# Altium schematic sheet PADS_Sheet_Yalovskyi.SchDoc
size A4; SheetNumber: 1; SheetTotal: 1
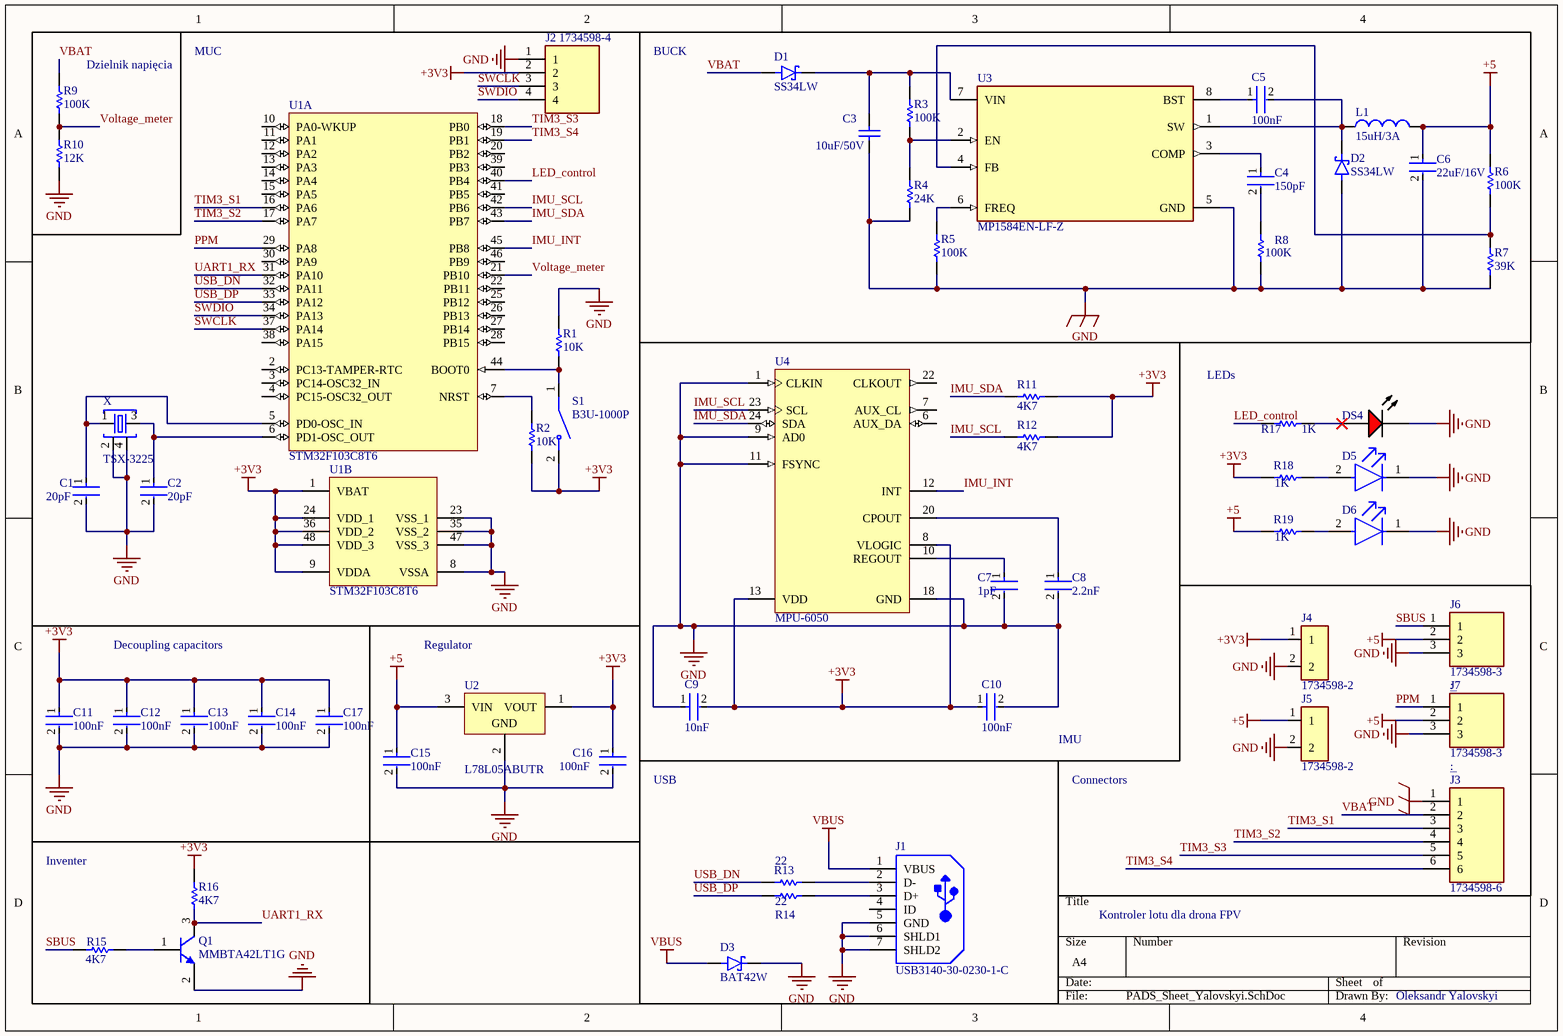
[diagram p0: PADS_Sheet_Yalovskyi.SchDoc]

## Parts
C1  20pF  [FP-C0402-BB-MFG]
C2  20pF  [FP-C0402-BB-MFG]
C3  10uF/50V  [KEMT-1206-2_M]
C4  150pF  [FP-C0402-BB-MFG]
C5  100nF  [FP-C0402-BB-MFG]
C6  22uF/16V  [FP-C0402-BB-MFG]
C7  1pF  [FP-C0402-BB-MFG]
C8  2.2nF  [FP-C0402-BB-MFG]
C9  10nF  [FP-C0402-BB-MFG]
C10  100nF  [FP-C0402-BB-MFG]
C11  100nF  [FP-C0402-BB-MFG]
C12  100nF  [FP-C0402-BB-MFG]
C13  100nF  [FP-C0402-BB-MFG]
C14  100nF  [FP-C0402-BB-MFG]
C15  100nF  [FP-C0402-BB-MFG]
C16  100nF  [FP-C0402-BB-MFG]
C17  100nF  [FP-C0402-BB-MFG]
D1  SS34LW  [SODFL3718X102N]
D2  SS34LW  [SODFL3718X102N]
D3  BAT42W  [DIO_BAT42W_RHG]
D5  (no value)  [FP-LTST-C190GKT-MFG]
D6  (no value)  [FP-LTST-C191TBKT-MFG]
DS4  (no value)  [VISH-TLMX1100_V]
J1  USB3140-30-0230-1-C  [GCT-USB3140_V]
J2  1734598-4  [TE_1734598-4]
J3  1734598-6  [TE_1734598-6]
J4  1734598-2  [TE_1734598-2]
J5  1734598-2  [TE_1734598-2]
J6  1734598-3  [TE_1734598-3]
J7  1734598-3  [TE_1734598-3]
L1  15uH/3A  [INDC1608X90X30LL10T20]
Q1  MMBTA42LT1G  [ONSC-SOT-23-3-318-08_V]
R1  10K  [RESC2013X50X30LL20T20]
R2  10K  [RESC2013X50X30LL20T20]
R3  100K  [RESC1005X40X25ML05T10]
R4  24K  [RESC1005X40X25ML05T10]
R5  100K  [RESC1005X40X25ML05T10]
R6  100K  [RESC1005X40X25ML05T10]
R7  39K  [RESC1005X40X25ML05T10]
R8  100K  [RESC1005X40X25ML05T10]
R9  100K  [RESC2013X50X30LL20T20]
R10  12K  [RESC2013X50X30LL20T20]
R11  4K7  [RESC1005X40X25ML05T10]
R12  4K7  [RESC1005X40X25ML05T10]
R13  22  [RESC2013X50X30LL20T20]
R14  22  [RESC2013X50X30LL20T20]
R15  4K7  [RESC2013X50X30LL20T20]
R16  4K7  [RESC2013X50X30LL20T20]
R17  1K  [RESC2013X50X30LL20T20]
R18  1K  [RESC2013X50X30LL20T20]
R19  1K  [RESC2013X50X30LL20T20]
S1  B3U-1000P  [SW_B3U-1000P]
U1  STM32F103C8T6  [STM-LQFP48_L]  (parts A,B of 2)
U2  L78L05ABUTR  [SOT-89_N]
U3  MP1584EN-LF-Z  [FP-MP1584EN-LF-Z-MFG]
U4  MPU-6050  [IS-QFN-24_V]
X  TSX-3225  [TSX-3225]

## Blocks framed on the sheet
Dzielnik napięcia: R9 R10
MUC: C1 C2 J2 R1 R2 S1 U1 X
BUCK: C3-C6 D1 D2 L1 R3-R8 U3
IMU: C7-C10 R11 R12 U4
Decoupling capacitors: C11-C14 C17
Regulator: C15 C16 U2
Connectors: J3-J7
Inventer: Q1 R15 R16

## Nets
+3V3: C9.2 C10.1 C11.1 C12.1 C13.1 C14.1 C16.1 C17.1 J2.2 J4.1 R2.1 R11.1 R12.1 R16.2 R18.2 S1.2 U1.1(VBAT) U1.9(VDDA) U1.24(VDD_1) U1.36(VDD_2) U1.48(VDD_3) U2.1(VOUT) U4.8(VLOGIC) U4.13(VDD)
+5: C6.1 C15.1 J5.1 J6.2 J7.2 L1.2 R6.2 R19.2 U2.3(VIN)
GND: C1.2 C2.2 C3.2 C6.2 C7.2 C8.2 C9.1 C10.2 C11.2 C12.2 C13.2 C14.2 C15.2 C16.2 C17.2 D2.A D3.C(K) D5.1(C) D6.1(C) DS4.2(K) J1.5(GND) J1.6(SHLD1) J1.7(SHLD2) J2.1 J3.1 J4.2 J5.2 J6.3 J7.3 Q1.2(E) R1.2 R4.1 R5.1 R7.1 R8.1 R10.1 U1.8(VSSA) U1.23(VSS_1) U1.35(VSS_2) U1.47(VSS_3) U2.2(GND) U3.5(GND) U4.1(CLKIN) U4.9(AD0) U4.11(FSYNC) U4.18(GND) X.2 X.4
VBUS: D3.A J1.1(VBUS)
IMU_INT: U1.45(PB8) U4.12(INT)
IMU_SCL: R12.2 U1.42(PB6) U4.23(SCL)
IMU_SDA: R11.2 U1.43(PB7) U4.24(SDA)
LED_control: R17.2 U1.40(PB4)
PPM: J7.1 U1.29(PA8)
SBUS: J6.1 R15.2
SWCLK: J2.3 U1.37(PA14)
SWDIO: J2.4 U1.34(PA13)
TIM3_S1: J3.3 U1.16(PA6)
TIM3_S2: J3.4 U1.17(PA7)
TIM3_S3: J3.5 U1.18(PB0)
TIM3_S4: J3.6 U1.19(PB1)
UART1_RX: Q1.3(C) R16.1 U1.31(PA10)
USB_DN: R13.2 U1.32(PA11)
USB_DP: R14.2 U1.33(PA12)
VBAT: D1.A J3.2 R9.2
Voltage_meter: R9.1 R10.2 U1.21(PB10)
NetC1_1: C1.1 U1.5(PD0-OSC_IN) X.1
NetC2_1: C2.1 U1.6(PD1-OSC_OUT) X.3
NetC3_1: C3.1 D1.C(K) R3.2 U3.7(VIN)
NetC4_1: C4.1 U3.3(COMP)
NetC4_2: C4.2 R8.2
NetC5_1: C5.1 U3.8(BST)
NetC5_2: C5.2 D2.C(K) L1.1 U3.1(SW)
NetC7_1: C7.1 U4.10(REGOUT)
NetC8_1: C8.1 U4.20(CPOUT)
NetD5_2: D5.2(A) R18.1
NetD6_2: D6.2(A) R19.1
NetDS4_1: DS4.1(A) R17.1
NetJ1_2: J1.2(D-) R13.1
NetJ1_3: J1.3(D+) R14.1
NetQ1_1: Q1.1(B) R15.1
NetR1_1: R1.1 S1.1 U1.44(BOOT0)
NetR2_2: R2.2 U1.7(NRST)
NetR3_1: R3.1 R4.2 U3.2(EN)
NetR5_2: R5.2 U3.6(FREQ)
NetR6_1: R6.1 R7.2 U3.4(FB)

Not connected (* = marked no-connect by the designer): J1 4(ID); U1 2(PC13-TAMPER-RTC) 3(PC14-OSC32_IN) 4(PC15-OSC32_OUT) 10(PA0-WKUP) 11(PA1) 12(PA2) 13(PA3) 14(PA4) 15(PA5) 20(PB2) 22(PB11) 25(PB12) 26(PB13) 27(PB14) 28(PB15) 30(PA9) 38(PA15) 39(PB3) 41(PB5) 46(PB9); U4 6(AUX_DA) 7(AUX_CL) 22(CLKOUT)

## Notes on the sheet
- LEDs
- (near C16) USB
- Kontroler lotu dla drona FPV
- Oleksandr Yalovskyi

## Library data of the parts
C1 C2 C4-C17 = CMP-2008-02046-2: CAP CER 0.1UF 10V X5R 0402; Manufacturer: Kemet; Manufacturer Part Number: C0402C104K8PACTU; Material: Ceramic; Capacitance: 0.10 μF; Temperature Coefficient: 15%; Tolerance: 0.1; Value: 0.10 μF; Package: C0402-BB; Temperature: -55°C to +125°C; ComponentLink2Description: Datasheet; Temperature Characteristic: X5R; Device Class L1: Passive Components; Height: 0.55mm; Lead Free: Yes; ComponentLink2URL: https://content.kemet.com/datasheets/KEM_C1002_X7R_SMD.pdf; Device Class L2: Capacitors; Temperature Range Low: -55°C; Temperature Range High: +125°C; RoHS: TRUE; Octopart: https://octopart.com/c0402c104k8pactu-kemet-140039; Automotive: No; Mouser Description: Capacitor 100 nF 10 VDC 0402; Category: Cap; Voltage Rating: 10 V; Digikey Description: CAP CER 0.1UF 10V X5R 0402; Ipc Land Pattern Name: CAPC10050X50; Device Class L3: Ceramic Capacitors
C3 = CMP-1037-04202-2: CAP, Ceramic, 0.1 uF, +/- 10%, 50 V, -55 to 125 degC, 1206 (3216 Metric), RoHS, Tape and Reel; Manufacturer: Kemet; Voltage Rating: 50V; Capacitance: 0.1µF; Product Range: KEMET-CSeries; SVHC: ToBeAdvised; Dielectric Characteristic: X7R; Capacitor Case Style: 1206[3216Metric]; Package Reference: 1206-2; Package Description: 2-Leads SMD, Body 3.2 x 1.6 mm; Packaging: Tape&Reel; Operating Temperature Max: 125degC; Capacitance Tolerance: ±10%; Datasheet URL: https://datasheet.ciiva.com/6125/1725438-6125494.pdf; Manufacturer URL: http://www.kemet.com/; Operating Temperature Min: -55degC; Datasheet Version: Jul-13
D1 D2 = SS34LW: 3A, 40V, Schottky Rectifier; MF: Taiwan Semiconductor; Value: *; Check_prices: https://www.snapeda.com/parts/SS34LW/Taiwan+Semiconductor/view-part/?ref=eda; MP: SS34LW; Package: SOD-123W-2 Taiwan Semiconductor; Availability: In Stock; Price: None; SnapEDA_Link: https://www.snapeda.com/parts/SS34LW/Taiwan+Semiconductor/view-part/?ref=snap; Purchase-URL: https://pricing.snapeda.com/search/part/SS34LW/?ref=eda
D3 = BAT42W_RHG: SOD-123, 30V, 0.2A, Schottky Diode; MF: Taiwan Semiconductor Corporation; MP: BAT42W RHG; Value: *; SnapEDA_Link: https://www.snapeda.com/parts/BAT42W%20RHG/Taiwan+Semiconductor/view-part/?ref=snap; Availability: In Stock; Price: None; Check_prices: https://www.snapeda.com/parts/BAT42W%20RHG/Taiwan+Semiconductor/view-part/?ref=eda; Purchase-URL: https://pricing.snapeda.com/search/part/BAT42W RHG/?ref=eda; Package: SOD-123-2 Taiwan Semiconductor
D5 = CMP-22017-000005-2: LED GREEN CLEAR CHIP SMD; Dominant Wavelength: 569nm; Reverse Voltage: 5V; Lens Color: Colorless; Viewing Angle: 130°; Voltage: 2V; Forward Current: 30mA; Power Dissipation: 100mW; Luminous Intensity: 6mcd; Number of LEDs: 1; Forward Voltage: 2.1V; Wavelength: 565nm; Test Current: 10mA; Min Operating Temperature: -55°C; Lens Style: Clear; Mount: Surface Mount; Width: 0.8mm; Packaging: Tape and Reel; Lens Transparency: Clear; Case Code (Metric): 1608; Depth: 0.8mm; Case Code (Imperial): 0603; Case/Package: 0603; Number of Pins: 2; Max Operating Temperature: 85°C; Lead Free: Lead Free; Number of Elements: 1; Length: 1.6mm; Height: 0.8mm; Package Quantity: 1; Power Rating: 100mW; Radiation Hardening: No; Illumination Color: Green; Color: Green
D6 = CMP-22017-000008-1: LED BLUE CLEAR CHIP SMD; Lens Color: Colorless; Dominant Wavelength: 475nm; Forward Current: 20mA; Wavelength: 468nm; Viewing Angle: 130°; Power Dissipation: 76mW; Luminous Intensity: 180mcd; Reverse Voltage: 5V; Number of Elements: 1; Lens Style: Diffused; Forward Voltage: 3.8V; Max Power Dissipation: 75mW; Case Code (Metric): 1608; Packaging: Tape and Reel; Case/Package: 0603; Depth: 1.6mm; Mount: Surface Mount; Lead Free: Lead Free; Min Operating Temperature: -20°C; Lens Transparency: Clear; Illumination Color: Blue; Height: 0.55mm; Test Current: 20mA; Case Code (Imperial): 0603; Max Operating Temperature: 80°C; Number of Pins: 2; Length: 0.8mm; Radiation Hardening: No; Package Quantity: 1; Number of LEDs: 1; Width: 0.8mm; Color: Blue
DS4 = CMP-1666-00027-1: LED, RED, 2.1 V, -40 to 100 degC, 2-Pin SMD (0603), RoHS, Tape and Reel; Type (Capacitors): C0G; Resistance: 100000000000 Ohm; Capacitance: 12 pF; Voltage Rating: 50 V; Tolerance: 5%; Min Operating Temperature: -55degC; REACH SVHC: No SVHC; ComponentLink2Description: Datasheet; ComponentLink1URL: http://www.vishay.com/; Width: 0.8 mm; Package Quantity: 4000; PackageReference: TLMX1100; ComponentLink2URL: http://www.vishay.com/docs/83173/tlmb1100.pdf; Case/Package: 0603; Case Code (Metric): 1608; Packaging: Tape and Reel; Pins: 2; ComponentLink1Description: Manufacturer URL; Max Operating Temperature: 125degC; Height: 0.8 mm; Length: 1.6 mm; Mount: Surface Mount; PackageDescription: 2-Pin Surface Mount Device, Body 1.6 x 0.8 mm; DatasheetVersion: Rev. 2.7, 03/2016; Case Code (Imperial): 0603; Voltage Rating (DC): 50 V; RoHSCompliant: True; Radiation Hardening: No
J1 = CMP-2000-07368-1: Micro USB Receptacle, Type B, SMT, Vertical, with Through-Hole Shell Stakes, -30 to 85 degC, 5-Pin SMD, RoHS, Tape and Reel; Manufacturer: Global Connector Technology; Connector Mounting: PCB; SVHC: NoSVHC(19-Dec-2012); No. of Positions: 5; Connector Type: USB2.0MicroB; No. of Rows: 1; Contact Termination: SurfaceMountVertical; Pitch: 0.65mm; Contact Material: Copper; Gender: Receptacle; PartNumber: USB3140; Series: USB3140; Datasheet URL: http://www.farnell.com/datasheets/1913332.pdf; Contact Plating: Gold; Manufacturer URL: http://gct.co/; Package Reference: USB3140; No. of Contacts: 5; Orientation: Vertical; Datasheet Version: Rev. B2, 04/2015; Package Description: 5-Pin Surface Mount Device, Body 7.8 x 4 mm, Pitch 0.65 mm; Mounting Technology: SurfaceMount
J2 = 1734598-4: Conn High Performance Interconnect HDR 4 POS 1.25mm Solder ST Thru-Hole Tube; MF: TE Connectivity; EU_RoHS_Compliance: Compliant; Digi-Key_Purchase_URL: https://www.digikey.com/product-detail/en/te-connectivity-amp-connectors/1734598-4/A99916-ND/2074075?utm_source=snapeda&utm_medium=aggregator&utm_campaign=symbol; Digi-Key_Part_Number: A99916-ND; TE_purchase_URL: https://www.te.com/usa-en/product-1734598-4.html?te_bu=Cor&te_type=disp&te_campaign=seda_glo_cor-seda-global-disp-prtnr-fy19-seda-model-bom-cta_sma-317_1&elqCampaignId=32493; Package: None; SnapEDA_Link: https://www.snapeda.com/parts/1734598-4/TE%20Connectivity%20AMP%20Connectors/view-part/2374854/?ref=snap; Value: *; MP: 1734598-4
J3 = 1734598-6: 1.25 WTB HDR DIP, 6 POS; Number_of_Positions: 6; MF: TE Connectivity; Product_Type: Connector; Centerline_Pitch: 1.25 mm[.049 in]; Value: *; Price: None; Package: None; TE_purchase_URL: https://www.te.com/usa-en/product-1734598-6.html?te_bu=Cor&te_type=disp&te_campaign=seda_glo_cor-seda-global-disp-prtnr-fy19-seda-model-bom-cta_sma-317_1&elqCampaignId=32493; Availability: Unavailable; SnapEDA_Link: https://www.snapeda.com/parts/1734598-6/TE%20Connectivity%20AMP%20Connectors/view-part/502603/?ref=snap; EU_RoHS_Compliance: Compliant; MP: 1734598-6
J4 J5 = 1734598-2: Conn Shrouded Header HDR 2 POS 1.25mm Solder ST Thru-Hole Tube; MF: {'manufacturer': 'TE Connectivity'}; Availability: Unavailable; Price: None; MP: 1734598-2; Package: None; Value: *
J6 J7 = 1734598-3: Conn Shrouded Header HDR 3 POS 1.25mm Solder ST Thru-Hole Tube; MF: TE Connectivity; MP: 1734598-3; Purchase-URL: https://pricing.snapeda.com/search/part/1734598-3/?ref=eda; Price: None; Availability: Good; Package: None; EU_RoHS_Compliance: Compliant; SnapEDA_Link: https://www.snapeda.com/parts/1734598-3/TE%20Connectivity%20AMP%20Connectors/view-part/2374853/?ref=snap; Value: *
L1 = CMP-2000-05913-1: Unshielded Wirewound Inductor, 33 nH, 350 mA, -55 to 150 degC, 0603 (1608 Metric), RoHS, Tape and Reel; Manufacturer: EPCOS-(TDK); Q @ Freq: 14@100MHz; Inductance: 33nH; Material - Core: Ceramic; Frequency - Self Resonant: 3GHz; DC Resistance (DCR): 600mOhmMax; Tolerance: ±5%; Frequency - Test: 100MHz; Current Rating: 350mA; Manufacturer URL: http://www.tdk.com/; Type: Wirewound; Mounting Type: SurfaceMount; Mounting Technology: SurfaceMount; Height - Seated (Max): 0.035"(0.90mm); Datasheet URL: https://en.tdk.eu/inf/30/db/ind_2008/b82496c.pdf; Shielding: Unshielded; Operating Temperature: -; Size / Dimension: 0.063"Lx0.031"W(1.60mmx0.80mm); Series: SIMID; Current - Saturation: -; Ratings: AEC-Q200; Packaging: CutTape(CT); Package Reference: 0603; Datasheet Version: 07/2016; Category: Inductors,Coils,Chokes; Package Description: 2-Pin Surface Mount Device, Body 1.6 x 0.8 mm; Family: FixedInductors; Package / Case: 0603(1608Metric)
Q1 = CMP-1048-00662-1: High Voltage Transistor, NPN Silicon, 3-Pin SOT-23, Pb-Free, Tape and Reel; Manufacturer: On Semiconductor; fT Min (MHz): 50; IC Continuous (A): 0.5; ComponentLink1URL: http://www.onsemi.com/; ComponentLink3URL: http://www.onsemi.cn/pub_link/Collateral/318-08.PDF; RoHS: TRUE; ComponentLink2Description: Datasheet; PartNumber: MMBTA42LT1G; Polarity: NPN; DatasheetVersion: Rev. 12; PackageReference: SOT-23-3-318-08; PackageDescription: 3-Pin Small Outline Transistor, Body 2.92 x 1.3 mm, Pitch 0.95 mm; ComponentLink3Description: Package Specification; ComponentLink1Description: Manufacturer URL; Packing: Tape and Reel; PackageVersion: Rev. AP, 11/2009; Mounting Technology: Surface Mount; ComponentLink2URL: http://www.onsemi.cn/pub_link/Collateral/MMBTA42LT1-D.PDF
R1 R2 R9 R10 R13-R19 = CMP-2001-04896-1: Manufacturer: Vishay Dale; Part Number: CRCW08050000Z0EA
R3-R8 R11 R12 = CMP-2002-03041-1: Part Number: CRCW04020000Z0EDHP; Manufacturer: Vishay Dale
S1 = B3U-1000P: Switch Tactile N.O. SPST Round Button Gull Wing 0.05A 12VDC 1.5N SMD Embossed T/R; Price: None; MP: B3U-1000P; Availability: Unavailable; Value: *; Package: None
U1 = CMP-0237-00215-3: ARM Cortex-M3 32-bit MCU, 64 KB Flash, 20 KB Internal RAM, 37 I/Os, 48-pin LQFP, -40 to 85 degC, Tray; Supply Voltage(Vcc) min (V): 2; Internal RAM Size (kB): 20; FLASH Size (Prog) (kB): 64; A/D Converter: 2x12-bit (10 Channel); I/Os (High Current): 37; Operating Frequency(F) (Processor speed) (MHz): 72; Core: ARM Cortex-M3; ComponentLink3Description: Package Specification; Mounting Technology: Surface Mount; PartNumber: STM32F103C8T6; PackageReference: LQFP48; Packing: Tray; ComponentLink3URL: http://www.st.com/st-web-ui/static/active/en/resource/technical/document/datasheet/DM00058181.pdf; DatasheetVersion: Rev. 16; ComponentLink1URL: http://www.st.com/web/en/home.html; PackageVersion: Rev. 6, 06/2013; ComponentLink2URL: http://www.st.com/st-web-ui/static/active/en/resource/technical/document/datasheet/CD00161566.pdf; ComponentLink1Description: Manufacturer URL; ComponentLink2Description: Datasheet; PackageDescription: 48-Pin Low Profile Quad Flat Package, 7 x 7 mm Body, 0.5 mm Pitch
U2 = CMP-0244-00406-1: Positive Voltage Regulator, 5V, 4-Pin SOT-89, Tape and Reel; PackageVersion: 2011; DatasheetVersion: 1/02/2011; PackageDescription: 3-Pin SOT-89 Package 1.5 mm Pitch, 4.1 mm Lead Span; PackageReference: SOT-89; ComponentLink2Description: Datasheet; ComponentLink1URL: http://www.st.com; ComponentLink1Description: Manufacturer URL; ComponentLink2URL: http://www.st.com/internet/com/TECHNICAL_RESOURCES/TECHNICAL_LITERATURE/DATASHEET/CD00000446.pdf
U3 = CMP-57379-000006-1: IC REG BUCK ADJ 3A; Manufacturer: Monolithic Power Systems; Output Type: AdjustableProgrammable; Nominal Supply Current: 100uA; Switching Frequency: 100-1500kHz; Max Power Dissipation: 2.5W; Output Voltage: 0.8-25V; Max Junction Temp: +125°C; Min Supply Voltage: 4.5V; Max Supply Voltage: 28V; Number Of Outputs: 1; Standoff Height: 0mm; ComponentLink2URL: https://www.monolithicpower.com/en/documentview/productdocument/index/doc_url/L01QMTU4NF9yMS4wLnBkZg%3D%3D/release_date/MjAwOS0wNC0wOSAwMDowMDowMA%3D%3D/; Lead Free: Yes; Package: MP1584EN-LF-Z; Temperature Range Low: -20°C; Temperature: -20°C to +125°C; Height: 1.7mm; Ambient Temperature Range Low: -20°C; RoHS: TRUE; Automotive: No; Ipc Land Pattern Name: SOIC127P600X150-8; Ambient Temperature Range High: +85°C; Device Class L2: Power Management ICs; ComponentLink2Description: Datasheet; Manufacturer Part Number: MP1584EN-LF-Z; Device Class L3: Voltage Regulators - Switching; Octopart: https://octopart.com/mp1584en-lf-z-monolithic+power+systems-18629680; Category: IC; Output Current: 3A; Digikey Description: IC REG BUCK ADJ 3A; Temperature Range High: +125°C; Device Class L1: Integrated Circuits (ICs); Switching Topology: Buck
U4 = CMP-1753-00002-2: 3-Axis Gyroscope, Accelerometer and a Digital Motion Processor(TM) (DMP), 2.375 to 3.46 V, -40 to 85 degC, 24-Pin QFN, RoHS, Tape and Reel; Manufacturer: InvenSense; Featured Product: MPU-60506-Axis,IntegratedI²CSolution; Other Names: 1428-1007-2 / MPU6050; Sensor Type: MotionTracking; Online Catalog: MPU-6000™Series; Unit PriceUSD: Digital; Datasheet Version: Rev. 3.3, 05/2012; Category: Sensors,Transducers; Datasheet URL: http://datasheet.octopart.com/MPU-6050-InvenSense-datasheet-14421344.pdf; Family: Multifunction; Standard Package: 5,000; Manufacturer URL: http://www.invensense.com/; Output Type: Digital; Dynamic Catalog: MPU-6000™Series
X = TSX-3225: 16MHz Â±10ppm Crystal 9pF 60 Ohms 4-SMD, No Lead; MF: EPSON; Package: SMD-4 Epson; Price: None; SnapEDA_Link: https://www.snapeda.com/parts/TSX-3225/EPSON/view-part/557780/?ref=snap; Availability: Unavailable; Value: *; MP: TSX-3225